# Altium project EG701_BMS.PrjPcb (part 3 of 3)
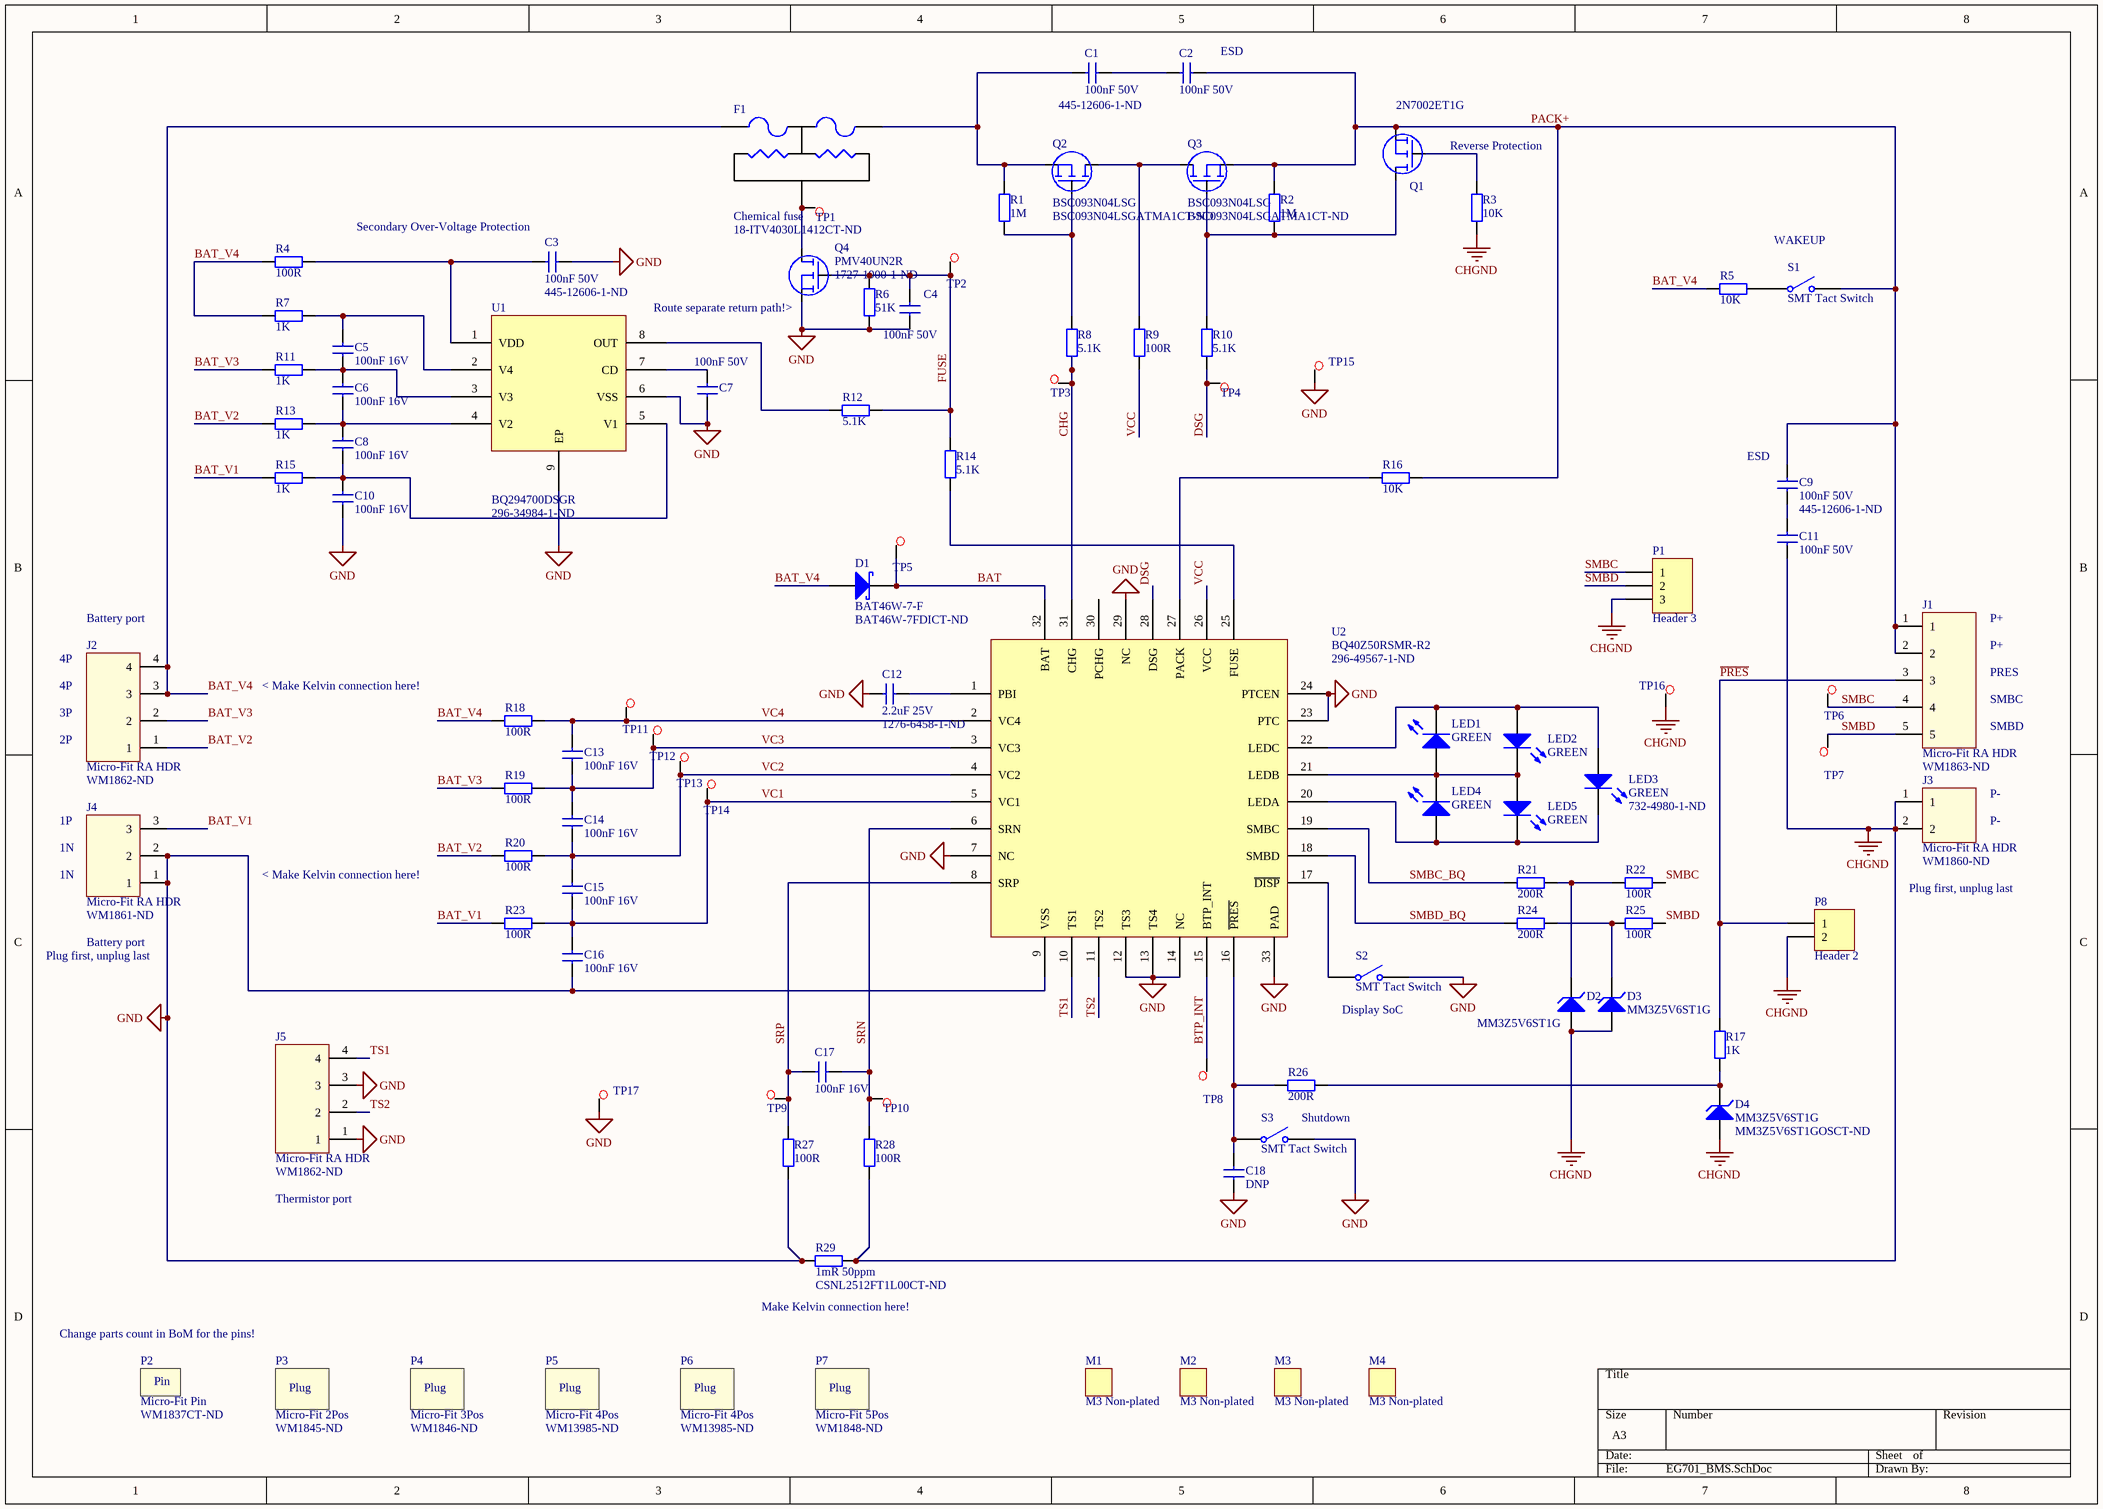
[diagram p2: EG701_BMS.SchDoc]

## Sheet EG701_BMS.SchDoc (continued)

### Library data of the parts (continued)
R6 = 51K_0603_1%_1/10W: RES SMD 51K OHM 1% 1/10W 0603; Manufacturer 1: Yageo; Manufacturer Part Number 1: RC0603FR-0751KL; Power Rating: 100mW; Resistance: 51kR; Voltage Rating: 50V; Temperature Coefficient: 100ppm/°C; Supplier 1: Digi-Key; Stock 1: 3246526; Pricing 1: 1=0.10000, 10=0.02200, 100=0.00900, 1000=0.00405, 2500=0.00352 (USD); RoHS: Yes; Case/Package: 0603; Case Code (Imperial): 0603; Case Code (Metric): 1608; Min Operating Temperature: -55°C; Max Operating Temperature: 155°C; Tolerance: 1%; Packaging: Tape and Reel; Package Quantity: 1; Termination: SMD/SMT; Composition: Thick Film; Number of Terminations: 2; Max Power Dissipation: 100mW; Voltage Rating (DC): 50V; Features: Moisture Resistant; Length: 1.6mm; Height: 0.45mm; Width: 0.8mm; Depth: 0.8mm; Lead Free: Lead Free; ComponentLink1URL: https://datasheet.ciiva.com/11819/0900766b80f96399-11819378.pdf?src-supplier=RSComponents; ComponentLink1Description: https://datasheet.ciiva.com/11819/0900766b80f96399-11819378.pdf?src-supplier=RSComponents; ComponentLink2URL: https://datasheet.ciiva.com/12558/rc0603-272842-12558554.pdf?src-supplier=Mouser; ComponentLink2Description: https://datasheet.ciiva.com/12558/rc0603-272842-12558554.pdf?src-supplier=Mouser; ComponentLink3URL: https://datasheet.ciiva.com/2454/pyu-r-int-thick-7-2454123.pdf?src-supplier=Digi-Key; ComponentLink3Description: https://datasheet.ciiva.com/2454/pyu-r-int-thick-7-2454123.pdf?src-supplier=Digi-Key; ComponentLink4URL: https://datasheet.ciiva.com/2454/pyu-r-int-thick-7-2454124.pdf?src-supplier=Digi-Key; ComponentLink4Description: https://datasheet.ciiva.com/2454/pyu-r-int-thick-7-2454124.pdf?src-supplier=Digi-Key; Supplier Part Number 1: 311-51.0KHRCT-ND; Number of Pins: 2; REACH SVHC: No SVHC; ComponentLink5URL: https://datasheet.ciiva.com/2454/pyu-r-int-thick-7-2454125.pdf?src-supplier=Digi-Key; ComponentLink5Description: https://datasheet.ciiva.com/2454/pyu-r-int-thick-7-2454125.pdf?src-supplier=Digi-Key; ComponentLink6URL: https://datasheet.ciiva.com/46395/443971-46395014.pdf?src-supplier=Element14; ComponentLink6Description: https://datasheet.ciiva.com/46395/443971-46395014.pdf?src-supplier=Element14
R7 R11 R13 R15 R17 = 1K_0603_1%_1/10W: RES SMD 1K OHM 1% 1/10W 0603; Manufacturer 1: Yageo; Manufacturer Part Number 1: RC0603FR-071KL; Resistance: 1kR; Temperature Coefficient: 100ppm/°C; Power Rating: 100mW; Voltage Rating: 50V; Supplier 1: Digi-Key; Stock 1: 40608315; Pricing 1: 1=0.10000, 10=0.02300, 100=0.00940, 1000=0.00421, 2500=0.00366 (USD); RoHS: Yes; Case/Package: 0603; Contact Plating: Tin,Matte; Case Code (Imperial): 0603; Case Code (Metric): 1608; Min Operating Temperature: -55°C; Max Operating Temperature: 155°C; Tolerance: 1%; Composition: Thick Film; Packaging: Tape and Reel; Termination: SMD/SMT; Military Standard: Not; Length: 1.6mm; Height: 0.45mm; Depth: 0.8mm; Radiation Hardening: No; REACH SVHC: No SVHC; Lead Free: Lead Free; ComponentLink1URL: https://datasheet.ciiva.com/11808/0900766b80f96399-11808081.pdf?src-supplier=RSComponents; ComponentLink1Description: https://datasheet.ciiva.com/11808/0900766b80f96399-11808081.pdf?src-supplier=RSComponents; ComponentLink2URL: https://datasheet.ciiva.com/25906/pyu-rc0603-51-rohs-l-4-25906933.pdf?src-supplier=Avnet+Europe; ComponentLink2Description: https://datasheet.ciiva.com/25906/pyu-rc0603-51-rohs-l-4-25906933.pdf?src-supplier=Avnet+Europe; ComponentLink3URL: https://datasheet.ciiva.com/7660/1868787-7660790.pdf?src-supplier=Element14; ComponentLink3Description: https://datasheet.ciiva.com/7660/1868787-7660790.pdf?src-supplier=Element14; ComponentLink4URL: https://datasheet.ciiva.com/7746/1738695-7746279.pdf?src-supplier=Element14; ComponentLink4Description: https://datasheet.ciiva.com/7746/1738695-7746279.pdf?src-supplier=Element14; ComponentLink5URL: https://datasheet.ciiva.com/7746/1686128-7746280.pdf?src-supplier=Element14; ComponentLink5Description: https://datasheet.ciiva.com/7746/1686128-7746280.pdf?src-supplier=Element14; ComponentLink6URL: https://datasheet.ciiva.com/28386/pyu-rc0603-51-rohs-l-4-28386648.pdf?src-supplier=Avnet+Europe; ComponentLink6Description: https://datasheet.ciiva.com/28386/pyu-rc0603-51-rohs-l-4-28386648.pdf?src-supplier=Avnet+Europe; ComponentLink7URL: https://datasheet.ciiva.com/7746/1738695-7746281.pdf?src-supplier=Element14; ComponentLink7Description: https://datasheet.ciiva.com/7746/1738695-7746281.pdf?src-supplier=Element14; ComponentLink8URL: https://datasheet.ciiva.com/8896/pyu-rc0603-51-rohs-l-4-8896106.pdf?src-supplier=Avnet; ComponentLink8Description: https://datasheet.ciiva.com/8896/pyu-rc0603-51-rohs-l-4-8896106.pdf?src-supplier=Avnet; ComponentLink9URL: https://datasheet.ciiva.com/15189/getdatasheetpartid-404327-15189644.pdf?src-supplier=Verical; ComponentLink9Description: https://datasheet.ciiva.com/15189/getdatasheetpartid-404327-15189644.pdf?src-supplier=Verical; ComponentLink10URL: https://datasheet.ciiva.com/7983/443971-7983613.pdf?src-supplier=Element14; ComponentLink10Description: https://datasheet.ciiva.com/7983/443971-7983613.pdf?src-supplier=Element14; Supplier Part Number 1: 311-1.00KHRDKR-ND
R8 R10 R12 R14 = 5K1_0603_1%_1/10W: RES SMD 5.1K OHM 1% 1/10W 0603; Manufacturer 1: Yageo; Manufacturer Part Number 1: RC0603FR-075K1L; Resistance: 5.1kR; Power Rating: 100mW; Voltage Rating: 50V; Temperature Coefficient: 100ppm/°C; Supplier 1: Digi-Key; Stock 1: 2194732; Pricing 1: 1=0.10000, 10=0.02200, 100=0.00900, 1000=0.00405, 2500=0.00352 (USD); RoHS: Yes; Case/Package: 0603; Number of Pins: 2; Case Code (Imperial): 0603; Case Code (Metric): 1608; Min Operating Temperature: -55°C; Max Operating Temperature: 155°C; Tolerance: 1%; Packaging: Tape and Reel; Package Quantity: 1; Termination: SMD/SMT; Composition: Thick Film; Number of Terminations: 2; Max Power Dissipation: 100mW; Voltage Rating (DC): 50V; Features: Moisture Resistant; Military Standard: Not; Length: 0.063inch; Height: 0.022inch; Width: 0.031inch; Depth: 0.8mm; Lead Free: Lead Free; REACH SVHC: No SVHC; ComponentLink1URL: https://datasheet.ciiva.com/46395/443971-46395016.pdf?src-supplier=Element14; ComponentLink1Description: https://datasheet.ciiva.com/46395/443971-46395016.pdf?src-supplier=Element14; ComponentLink2URL: https://datasheet.ciiva.com/15189/getdatasheetpartid-326732-15189786.pdf?src-supplier=Verical; ComponentLink2Description: https://datasheet.ciiva.com/15189/getdatasheetpartid-326732-15189786.pdf?src-supplier=Verical; ComponentLink3URL: https://datasheet.ciiva.com/2454/pyu-r-int-thick-7-2454045.pdf?src-supplier=Digi-Key; ComponentLink3Description: https://datasheet.ciiva.com/2454/pyu-r-int-thick-7-2454045.pdf?src-supplier=Digi-Key; ComponentLink4URL: https://datasheet.ciiva.com/2454/pyu-r-int-thick-7-2454046.pdf?src-supplier=Digi-Key; ComponentLink4Description: https://datasheet.ciiva.com/2454/pyu-r-int-thick-7-2454046.pdf?src-supplier=Digi-Key; ComponentLink5URL: https://datasheet.ciiva.com/2454/pyu-r-int-thick-7-2454047.pdf?src-supplier=Digi-Key; ComponentLink5Description: https://datasheet.ciiva.com/2454/pyu-r-int-thick-7-2454047.pdf?src-supplier=Digi-Key; Supplier Part Number 1: 311-5.10KHRCT-ND
R21 R24 R26 = 200R_0603_1%_1/10W: RES SMD 200 OHM 1% 1/10W 0603; Manufacturer 1: Yageo; Manufacturer Part Number 1: RC0603FR-07200RL; Temperature Coefficient: 100ppm/°C; Power Rating: 100mW; Voltage Rating: 50V; Working Voltage: 75V; Supplier 1: Digi-Key; Stock 1: 2577421; Pricing 1: 1=0.10000, 10=0.02200, 100=0.00900, 1000=0.00405, 2500=0.00352 (USD); RoHS: Yes; Case/Package: 0603; Number of Pins: 2; Case Code (Imperial): 0603; Case Code (Metric): 1608; Min Operating Temperature: -55°C; Max Operating Temperature: 155°C; Termination: SMD/SMT; Composition: Thick Film; Packaging: Tape and Reel; Resistance: 200R; Tolerance: 1%; Package Quantity: 5000; Voltage Rating (DC): 50V; Number of Terminations: 2; Military Standard: Not; Length: 1.6mm; Height: 0.45mm; Depth: 0.8mm; Width: 0.8mm; Lead Free: Lead Free; REACH SVHC: No SVHC; ComponentLink1URL: https://datasheet.ciiva.com/11809/0900766b80f96399-11809240.pdf?src-supplier=RSComponents; ComponentLink1Description: https://datasheet.ciiva.com/11809/0900766b80f96399-11809240.pdf?src-supplier=RSComponents; ComponentLink2URL: https://datasheet.ciiva.com/46395/443971-46395029.pdf?src-supplier=Element14; ComponentLink2Description: https://datasheet.ciiva.com/46395/443971-46395029.pdf?src-supplier=Element14; Supplier Part Number 1: 311-200HRCT-ND
R29 = 0.001R_2512_1%_2W_50ppm: RES 0.001 OHM 1% 2W 2512; Manufacturer 1: Stackpole Electronics; Manufacturer Part Number 1: CSNL2512FT1L00; Temperature Coefficient: 50ppm/°C; Supplier 1: Digi-Key; Stock 1: 126804; Pricing 1: 1=0.65000, 10=0.53900, 25=0.46200, 50=0.41580, 100=0.36190, 250=0.32340, 500=0.26180, 1000=0.21175 (USD); RoHS: Yes; Mount: Surface Mount; Case/Package: 2512; Contact Plating: Tin,Matte; Case Code (Metric): 6432; Case Code (Imperial): 2512; Min Operating Temperature: -55°C; Max Operating Temperature: 170°C; Max Power Dissipation: 2W; Composition: Metal Foil; Number of Terminations: 2; Packaging: Tape and Reel; Resistance: 1mR; Tolerance: 1%; Power Rating: 2W; Features: Moisture Resistant; Length: 0.25inch; Height: 0.033inch; Width: 0.125inch; Radiation Hardening: No; Lead Free: Lead Free; ComponentLink1URL: http://components.arrow.com/part/dataview/47858191S8378277N1174?src-supplier=Arrow; ComponentLink1Description: http://components.arrow.com/part/dataview/47858191S8378277N1174?src-supplier=Arrow; ComponentLink2URL: http://www.seielect.com/Catalog/SEI-csnl.pdf?src-supplier=Future+Electronics; ComponentLink2Description: http://www.seielect.com/Catalog/SEI-csnl.pdf?src-supplier=Future+Electronics; ComponentLink3URL: https://www.seielect.com/catalog/SEI-Packaging.pdf?src-supplier=Digi-Key; ComponentLink3Description: https://www.seielect.com/catalog/SEI-Packaging.pdf?src-supplier=Digi-Key; ComponentLink4URL: https://www.seielect.com/Catalog/SEI-csnl.pdf?src-supplier=Digi-Key; ComponentLink4Description: https://www.seielect.com/Catalog/SEI-csnl.pdf?src-supplier=Digi-Key; ComponentLink5URL: https://www.seielect.com/Catalog/SEI-CSNL.pdf?src-supplier=Avnet; ComponentLink5Description: https://www.seielect.com/Catalog/SEI-CSNL.pdf?src-supplier=Avnet
S1-S3 = 41-KRSM6-1: SMT tact switch from Hi-Q
TP1-TP17 = TP_5021: Thru Hole Mount Unisulated Test Point; Manufacturer 1: Keystone Electronics; Manufacturer Part Number 1: 5021; Plating: Silver; Body Material: Bronze; Supplier 1: Digi-Key; Stock 1: 36492; Pricing 1: 1=0.23000, 25=0.18760, 100=0.17820, 250=0.16780, 500=0.15050, 1000=0.10548, 2500=0.09669, 5000=0.09376, 10000=0.08497 (USD); RoHS: Yes; Mount: Through Hole; Contact Material: Bronze; Contact Plating: Silver; Color: Silver; Material: Bronze,Silver; Package Quantity: 100; Packaging: Bulk; Lead Free: Lead Free; REACH SVHC: No SVHC; ComponentLink1URL: https://datasheet.ciiva.com/15242/5021-15242766.pdf?src-supplier=Arrow+Europe; ComponentLink1Description: https://datasheet.ciiva.com/15242/5021-15242766.pdf?src-supplier=Arrow+Europe; ComponentLink2URL: https://datasheet.ciiva.com/2917/5021-2917622.pdf?src-supplier=Digi-Key; ComponentLink2Description: https://datasheet.ciiva.com/2917/5021-2917622.pdf?src-supplier=Digi-Key; Supplier Part Number 1: 36-5021-ND
U1 = BQ294700DSGR: IC BATT PROT 2-4CELL LIION 8WSON; Manufacturer 1: Texas Instruments; Output Voltage: 30V; Output Current: 4.5mA; Operating Supply Current: 1uA; Operating Supply Voltage: 20V; Supplier 1: Digi-Key; Manufacturer Part Number 1: BQ294700DSGR; Stock 1: 15401; Pricing 1: 1=0.86000, 10=0.75900, 25=0.71320, 100=0.54050, 250=0.46000, 500=0.43700, 1000=0.33350 (USD); RoHS: Yes; Mount: Surface Mount; Number of Pins: 8; Contact Plating: Gold; Min Operating Temperature: -40°C; Max Operating Temperature: 85°C; Packaging: Tape and Reel; Package Quantity: 1; Lead Free: Lead Free; ComponentLink1URL: https://datasheet.ciiva.com/6613/bq294700-6613741.pdf?src-supplier=Digi-Key; ComponentLink1Description: https://datasheet.ciiva.com/6613/bq294700-6613741.pdf?src-supplier=Digi-Key; ComponentLink2URL: https://datasheet.ciiva.com/6613/bq294700-6613742.pdf?src-supplier=Digi-Key; ComponentLink2Description: https://datasheet.ciiva.com/6613/bq294700-6613742.pdf?src-supplier=Digi-Key; ComponentLink3URL: https://datasheet.ciiva.com/6613/bq294700-6613743.pdf?src-supplier=Digi-Key; ComponentLink3Description: https://datasheet.ciiva.com/6613/bq294700-6613743.pdf?src-supplier=Digi-Key
U2 = BQ40Z50RSMR-R2: 1-4 series Li-ion battery pack manager supporting Turbo Mode 2.0 32-VQFN -40 to 85; Manufacturer 1: Texas Instruments; Fault Protection: Over Current,Over Temperature,Short Circuit,Over/Under Voltage; Interface: SMBus; Supplier 1: Digi-Key; Manufacturer Part Number 1: BQ40Z50RSMR-R2; Stock 1: 2467; Pricing 1: 1=5.59000, 10=5.02200, 25=4.74760, 100=3.90350, 250=3.50260, 500=3.37600, 1000=2.80630 (USD); RoHS: No; Case/Package: VQFN; Min Operating Temperature: -40°C; Max Operating Temperature: 85°C; Packaging: Cut Tape; ComponentLink1URL: http://www.ti.com/lit/ds/symlink/bq40z50-r2.pdf?src-supplier=Digi-Key; ComponentLink1Description: http://www.ti.com/lit/ds/symlink/bq40z50-r2.pdf?src-supplier=Digi-Key